# Altium project Framework 2 USB-C Expansion Card.PrjPcb
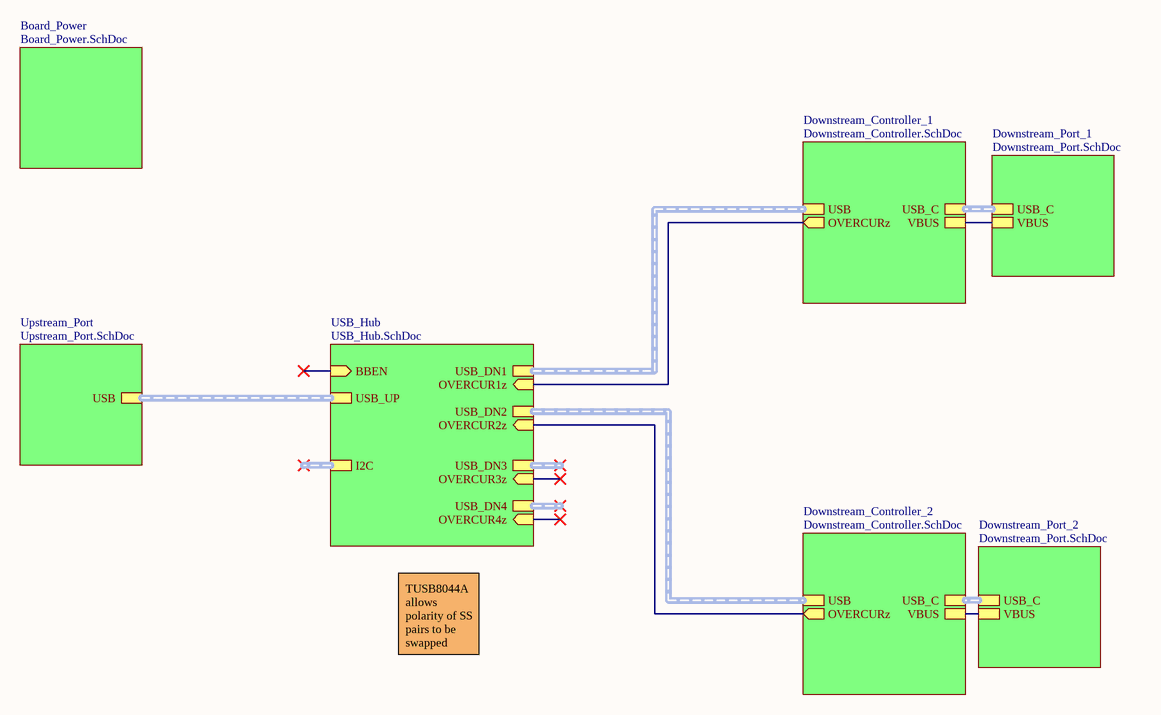
[diagram p0: Top.SchDoc]
CAGE_CODE: ?????; CONTRACT_NUMBER: <CONTRACT NO>; DOC_NO_ASSY_DWG: <ASSY DWG NO>; DOC_NO_BOM: <BOM DOC NO>; DOC_NO_FAB_DWG: <FAB DWG NO>; DOC_NO_SCH_DWG: <SCH DWG NO>; PCB_2_DEC_TOL: +/-.01; PCB_3_DEC_TOL: +/-.010; PCB_ANG_TOL: +/-1/2; PCB_ASSEMBLY_NO: <PCB ASSY NO>; PCB_CHECKER: - -----; PCB_CHECKER_APP_DATE: --/--/----; PCB_DESIGNER: - -----; PCB_DESIGNER_APP_DATE: --/--/----; PCB_DWG_NO: <PCB DWG NO>; PCB_ENGINEER: - -----; PCB_ENGINEER_APP_DATE: --/--/----; PCB_PART_NUMBER: <PCB PN>; PCB_REV: A; SCH_REV: A
6 sheets, 87 parts. Net scope: hierarchical (ports join the sheet entries above them; power ports are global).
Board file: PCB1.PcbDoc
Sheets:
  Top.SchDoc
    Downstream_Controller_1 = Downstream_Controller.SchDoc
    Upstream_Port = Upstream_Port.SchDoc
    Board_Power = Board_Power.SchDoc
    USB_Hub = USB_Hub.SchDoc
    Downstream_Controller_2 = Downstream_Controller.SchDoc
    Downstream_Port_1 = Downstream_Port.SchDoc
    Downstream_Port_2 = Downstream_Port.SchDoc

## Sheet Top.SchDoc: USBC Hub
size 431 x 279 mm; Author: Eric Liu; SheetNumber: 1; SheetTotal: 6

### Sub-sheets
Board_Power = Board_Power.SchDoc: no entries
Downstream_Controller_1 = Downstream_Controller.SchDoc: USB (harness USB), OVERCURz (out), USB_C (harness USB_C), VBUS
Downstream_Controller_2 = Downstream_Controller.SchDoc: USB (harness USB), OVERCURz (out), USB_C (harness USB_C), VBUS
Downstream_Port_1 = Downstream_Port.SchDoc: USB_C (harness USB_C), VBUS
Downstream_Port_2 = Downstream_Port.SchDoc: USB_C (harness USB_C), VBUS
Upstream_Port = Upstream_Port.SchDoc: USB (harness USB)
USB_Hub = USB_Hub.SchDoc: I2C (harness USB), USB_UP (harness USB), USB_DN1 (harness USB), USB_DN2 (harness USB), USB_DN3 (harness USB), USB_DN4 (harness USB), OVERCUR1z (in), OVERCUR2z (in), OVERCUR3z (in), OVERCUR4z (in), BBEN (in)

### Nets
OVERCURz: sheet Downstream_Controller_1/OVERCURz, sheet USB_Hub/OVERCUR1z
OVERCURz: sheet USB_Hub/OVERCUR2z, sheet Downstream_Controller_2/OVERCURz  [a separate net that carries the same name]
VBUS: sheet Downstream_Controller_1/VBUS, sheet Downstream_Port_1/VBUS
VBUS: sheet Downstream_Controller_2/VBUS, sheet Downstream_Port_2/VBUS  [a separate net that carries the same name]

### Buses and harness runs
harness sheet Downstream_Controller_1/USB = sheet USB_Hub/USB_DN1
harness sheet Downstream_Controller_1/USB_C = sheet Downstream_Port_1/USB_C
harness sheet Downstream_Controller_2/USB = sheet USB_Hub/USB_DN2
harness sheet Downstream_Controller_2/USB_C = sheet Downstream_Port_2/USB_C
harness sheet Upstream_Port/USB = sheet USB_Hub/USB_UP

### Notes on the sheet
- TUSB8044A allows polarity of SS pairs to be swapped
- DWG. NO.
- REV.
- SHT.
- THIS DOCUMENT AND THE DATA DISCLOSED HEREIN OR HEREWITH IS THE PROPERTY OF ALTIUM LIMITED AND MAY BE FREELY DISTRIBUTED IN WHOLE. NO RIGHTS ARE RESERVED OR EXPRESS OR IMPLIED WARANTEE GIVEN.
- REVISION
- DESCRIPTION
- DATE
- APPROVED
- ENG:
- APPROVALS
- PROJECT
- DSN:
- CHK:
- REFERENCE DOCUMENTS
- PROJECT REVISION:
- TITLE
- DOCUMENT REVISION:
- DESIGN ITEM:
- BOM:
- FAB DWG:
- PCB DWG:
- ASSY DWG:
- SCALE:
- SIZE
- B
- CAGE CODE
- FILE NAME
- DWG NO.
- SHEET
- OF
- REV

## Sheet Downstream_Controller.SchDoc: Downstream Controller
size 431 x 279 mm; Author: Eric Liu; SheetNumber: 2; SheetTotal: 6
Used 2 times, as channels Downstream_Controller_1, Downstream_Controller_2. Parts and nets are listed once, with the designators drawn on the sheet.
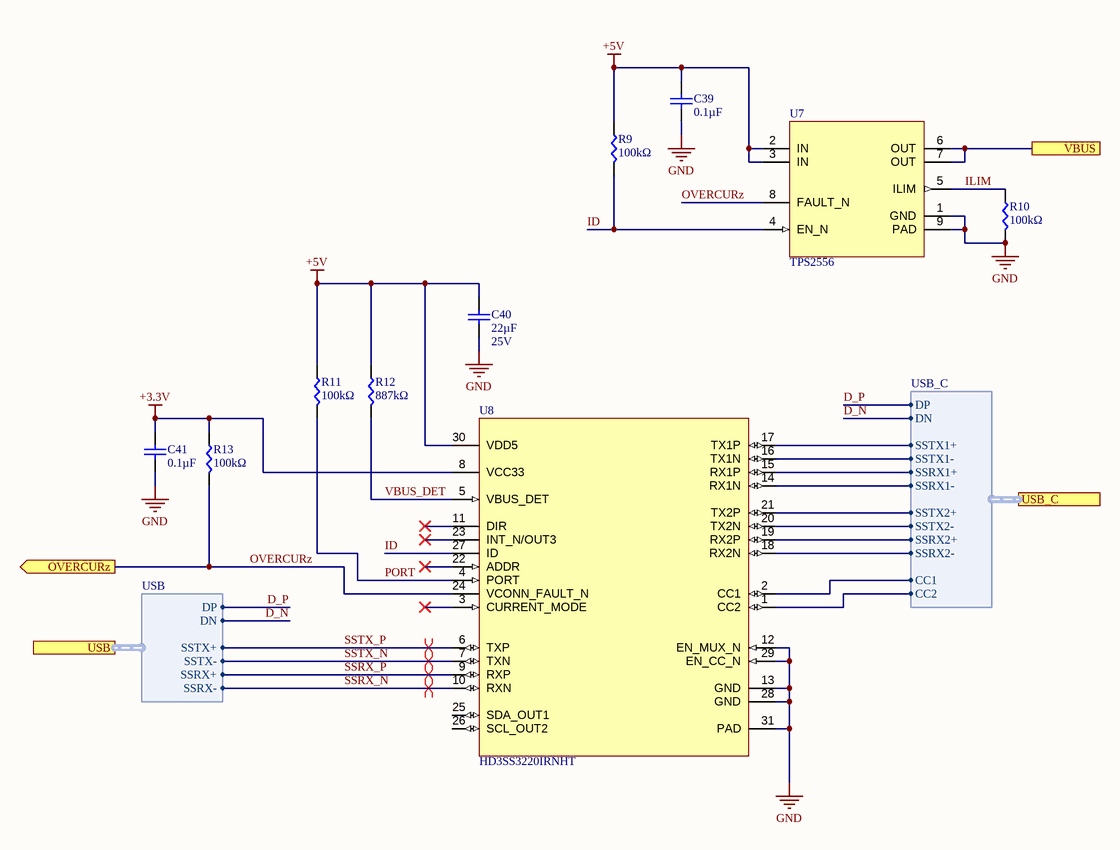
[diagram p1: Downstream_Controller.SchDoc]

### Parts
C39  value 0.1µF  [CAP0402]  (hidden comment: CC0402KRX5R9BB104)
C40  value 22µF  Voltage: 25V  [CAP0805]  (hidden comment: CL21A226MAYNNNE)
C41  value 0.1µF  [CAP0402]  (hidden comment: CC0402KRX5R9BB104)
R9  value 100kΩ  [RES0402]  (hidden comment: ERJ-2RKF1003X)
R10  value 100kΩ  [RES0402]  (hidden comment: ERJ-2RKF1003X)
R11  value 100kΩ  [RES0402]  (hidden comment: ERJ-2RKF1003X)
R12  value 887kΩ  [RES0402]  (hidden comment: RMCF0402FT887K)
R13  value 100kΩ  [RES0402]  (hidden comment: ERJ-2RKF1003X)
U7  TPS2556  [8-SON (3x3)]
U8  HD3SS3220IRNHT  [30-WFQFN Exposed Pad]

### Ports
OVERCURz (out), USB (harness USB), USB_C (harness USB_C), VBUS

### Harnesses
USB: DP, DN, SSRX+, SSRX-, SSTX+, SSTX-
USB_C: DP, DN, SSRX1+, SSRX1-, SSTX1+, SSTX1-, SSRX2+, SSRX2-, SSTX2+, SSTX2-, CC1, CC2

### Nets
+3.3V: C41.2 R13.2 U8.8(VCC33)
+5V: C39.2 C40.2 R9.2 R11.2 R12.2 U7.2(IN) U7.3(IN) U8.30(VDD5)
GND: C39.1 C40.1 C41.1 R10.1 U7.1(GND) U7.9(PAD) U8.12(EN_MUX_N) U8.13(GND) U8.28(GND) U8.29(EN_CC_N) U8.31(PAD)
D_N: port USB.DN, port USB_C.DN
D_P: port USB.DP, port USB_C.DP
ID: R9.1 U7.4(EN_N) U8.27(ID)
ILIM: R10.2 U7.5(ILIM)
OVERCURz: R13.1 U7.8(FAULT_N) U8.24(VCONN_FAULT_N) ; port OVERCURz
PORT: R11.1 U8.4(PORT)
SSRX_N: U8.10(RXN) ; port USB.SSRX-
SSRX_P: U8.9(RXP) ; port USB.SSRX+
SSTX_N: U8.7(TXN) ; port USB.SSTX-
SSTX_P: U8.6(TXP) ; port USB.SSTX+
VBUS: U7.6(OUT) U7.7(OUT) ; port VBUS
VBUS_DET: R12.1 U8.5(VBUS_DET)
NetU8_1: U8.1(CC2) ; port USB_C.CC2
NetU8_2: U8.2(CC1) ; port USB_C.CC1
NetU8_14: U8.14(RX1N) ; port USB_C.SSRX1-
NetU8_15: U8.15(RX1P) ; port USB_C.SSRX1+
NetU8_16: U8.16(TX1N) ; port USB_C.SSTX1-
NetU8_17: U8.17(TX1P) ; port USB_C.SSTX1+
NetU8_18: U8.18(RX2N) ; port USB_C.SSRX2-
NetU8_19: U8.19(RX2P) ; port USB_C.SSRX2+
NetU8_20: U8.20(TX2N) ; port USB_C.SSTX2-
NetU8_21: U8.21(TX2P) ; port USB_C.SSTX2+

Not connected (* = marked no-connect by the designer): U8 3(CURRENT_MODE)* 11(DIR)* 22(ADDR)* 23(INT_N/OUT3)* 25(SDA_OUT1) 26(SCL_OUT2)

### Channels
Downstream_Controller_1: designators end in _1; ports OVERCURz=OVERCURz VBUS=VBUS
Downstream_Controller_2: designators end in _2; ports OVERCURz=OVERCURz VBUS=VBUS

### Layout directives
differential pair: SSRX_N, SSRX_P, SSTX_N, SSTX_P

### Notes on the sheet
- DWG. NO.
- REV.
- SHT.
- THIS DOCUMENT AND THE DATA DISCLOSED HEREIN OR HEREWITH IS THE PROPERTY OF ALTIUM LIMITED AND MAY BE FREELY DISTRIBUTED IN WHOLE. NO RIGHTS ARE RESERVED OR EXPRESS OR IMPLIED WARANTEE GIVEN.
- REVISION
- DESCRIPTION
- DATE
- APPROVED
- ENG:
- APPROVALS
- PROJECT
- DSN:
- CHK:
- REFERENCE DOCUMENTS
- PROJECT REVISION:
- TITLE
- DOCUMENT REVISION:
- DESIGN ITEM:
- BOM:
- FAB DWG:
- PCB DWG:
- ASSY DWG:
- SCALE:
- SIZE
- B
- CAGE CODE
- FILE NAME
- DWG NO.
- SHEET
- OF
- REV

### Library data of the parts
C39 C41 = CC0402KRX5R9BB104: 0.1 µF ±10% 50V Ceramic Capacitor X5R 0402 (1005 Metric); Temperature Coefficient: X5R; Package: 0402 (1005 Metric); Voltage: 50V
C40 = CL21A226MAYNNNE: 22 µF ±20% 25V Ceramic Capacitor X5R 0805 (2012 Metric); Temperature Coefficient: X5R; Package: 0805 (2012 Metric)
R9-R11 R13 = ERJ-2RKF1003X: 100 kOhms ±1% 0.1W, 1/10W Chip Resistor 0402 (1005 Metric) Automotive AEC-Q200 Thick Film; Manufacturer 1: Panasonic Electronic Components; Manufacturer Part Number 1: ERJ-2RKF1003X; Supplier Part Number 1: P100KLCT-ND; Supplier 1: Digi-Key; Power Rating: 1/10W
R12 = RMCF0402FT887K: 887 kOhms ±1% 0.063W, 1/16W Chip Resistor 0402 (1005 Metric) Automotive AEC-Q200 Thick Film; Manufacturer 1: Stackpole Electronics Inc; Manufacturer Part Number 1: RMCF0402FT887K; Supplier Part Number 1: RMCF0402FT887KCT-ND; Supplier 1: Digi-Key; Power Rating: 1/16W
U7 = TPS2556: Power Switch/Driver 1:1 N-Channel 5A 8-SON (3x3); Manufacturer: Texas Instruments; Manufacturer Product Number: TPS2556DRBR; Supplier: DigiKey; Supplier Part Number: 296-39382-1-ND; Datasheet: https://www.ti.com/lit/ds/symlink/tps2557.pdf?ts=1772363913218; Operating Temperature: -40°C ~ 125°C
U8 = HD3SS3220IRNHT: USB, Type-C Controller PMIC 30-WQFN (4.5x2.5); Manufacturer: Texas Instruments; Manufacturer Product Number: HD3SS3220IRNHT; Supplier: DigiKey; Supplier Part Number: 296-43694-1-ND; Datasheet: https://www.ti.com/lit/ds/symlink/hd3ss3220.pdf?HQS=dis-dk-null-digikeymode-dsf-pf-null-wwe&ts=1772376564629&ref_url=https%253A%252F%252Fwww.ti.com%252Fgeneral%252Fdocs%252Fsuppproductinfo.tsp%253FdistId%253D10%2526gotoUrl%253Dhttps%253A%252F%252Fwww.ti.com%252Flit%252Fgpn%252Fhd3ss3220; Operating Temperature: -40°C ~ 85°C

## Sheet Upstream_Port.SchDoc: Upstream Port
size 431 x 279 mm; Author: Eric Liu; SheetNumber: 4; SheetTotal: 6
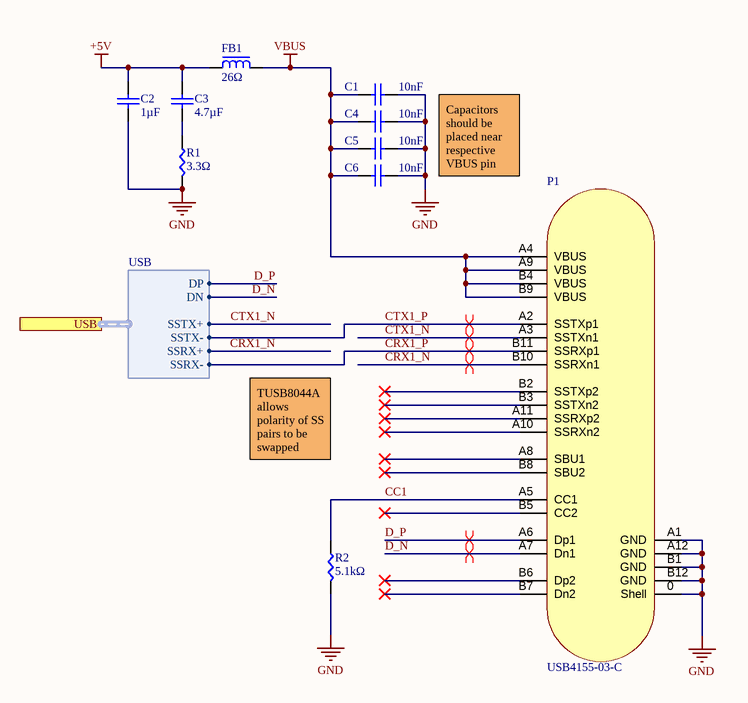
[diagram p2: Upstream_Port.SchDoc]

### Parts
C1  value 10nF  [CAP0402]  (hidden comment: CC0402KRX7R9BB103)
C2  value 1µF  [CAP0402]  (hidden comment: GRM155R61H105KE05D)
C3  value 4.7µF  [CAP0603]  (hidden comment: GRM188R61E475KE11D)
C4  value 10nF  [CAP0402]  (hidden comment: CC0402KRX7R9BB103)
C5  value 10nF  [CAP0402]  (hidden comment: CC0402KRX7R9BB103)
C6  value 10nF  [CAP0402]  (hidden comment: CC0402KRX7R9BB103)
FB1  value 26Ω  [BLM18SG260TN1D]  (hidden comment: BLM18SG260TN1D)
P1  USB4155-03-C  [USB4155-03-C]
R1  value 3.3Ω  [RES0402]  (hidden comment: ESR10EZPJ3R3)
R2  value 5.1kΩ  [RES0402]  (hidden comment: RC0402FR-075K1L)

### Ports
USB (harness USB)

### Harnesses
USB: DP, DN, SSRX+, SSRX-, SSTX+, SSTX-

### Nets
+5V: C2.2 C3.2 FB1.1
GND: C1.1 C2.1 C4.1 C5.1 C6.1 P1.0(Shell) P1.A1(GND) P1.A12(GND) P1.B1(GND) P1.B12(GND) R1.1 R2.1
VBUS: C1.2 C4.2 C5.2 C6.2 FB1.2 P1.A4(VBUS) P1.A9(VBUS) P1.B4(VBUS) P1.B9(VBUS)
CC1: P1.A5(CC1) R2.2
CRX1_N: P1.B10(SSRXn1) ; port USB.SSRX+
CRX1_P: P1.B11(SSRXp1) ; port USB.SSRX-
CTX1_N: P1.A3(SSTXn1) ; port USB.SSTX+
CTX1_P: P1.A2(SSTXp1) ; port USB.SSTX-
D_N: P1.A7(Dn1) ; port USB.DN
D_P: P1.A6(Dp1) ; port USB.DP
NetC3_1: C3.1 R1.2

Not connected (* = marked no-connect by the designer): P1 A8(SBU1)* A10(SSRXn2)* A11(SSRXp2)* B2(SSTXp2)* B3(SSTXn2)* B5(CC2)* B6(Dp2)* B7(Dn2)* B8(SBU2)*

### Layout directives
differential pair: CRX1_N, CRX1_P, CTX1_N, CTX1_P, D_N, D_P

### Notes on the sheet
- Capacitors should be placed near respective VBUS pin
- TUSB8044A allows polarity of SS pairs to be swapped
- DWG. NO.
- REV.
- SHT.
- THIS DOCUMENT AND THE DATA DISCLOSED HEREIN OR HEREWITH IS THE PROPERTY OF ALTIUM LIMITED AND MAY BE FREELY DISTRIBUTED IN WHOLE. NO RIGHTS ARE RESERVED OR EXPRESS OR IMPLIED WARANTEE GIVEN.
- REVISION
- DESCRIPTION
- DATE
- APPROVED
- ENG:
- APPROVALS
- PROJECT
- DSN:
- CHK:
- REFERENCE DOCUMENTS
- PROJECT REVISION:
- TITLE
- DOCUMENT REVISION:
- DESIGN ITEM:
- BOM:
- FAB DWG:
- PCB DWG:
- ASSY DWG:
- SCALE:
- SIZE
- B
- CAGE CODE
- FILE NAME
- DWG NO.
- SHEET
- OF
- REV

### Library data of the parts
C1 C4-C6 = CC0402KRX7R9BB103: 10000 pF ±10% 50V Ceramic Capacitor X7R 0402 (1005 Metric); Temperature Coefficient: X7R; Package: 0402 (1005 Metric); Voltage: 50V
C2 = GRM155R61H105KE05D: 1 µF ±10% 50V Ceramic Capacitor X5R 0402 (1005 Metric); Temperature Coefficient: X5R; Package: 0402 (1005 Metric); Voltage: 50V
C3 = GRM188R61E475KE11D: 4.7 µF ±10% 25V Ceramic Capacitor X5R 0603 (1608 Metric); Temperature Coefficient: X5R; Package: 0603 (1608 Metric); Voltage: 25V
FB1 = BLM18SG260TN1D: 26 Ohms @ 100 MHz 1 Power Line Ferrite Bead 0603 (1608 Metric) 6A 7mOhm; Manufacturer 1: Murata Electronics; Manufacturer Part Number 1: BLM18SG260TN1D; Supplier Part Number 1: 490-3995-1-ND; Supplier 1: Digi-Key; Current Rating: 6A
P1 = USB4155-03-C: USB-C (USB TYPE-C) USB 3.2 Gen 2 (USB 3.1 Gen 2, Superspeed + (USB 3.1)) Plug Connector 24 Position Board Edge, Surface Mount; Through Hole, Right Angle; Manufacturer: GCT; Manufacturer Product Number: USB4056-03-A; Voltage: 48VDC; Supplier: DigiKey; Supplier Part Number: 2073-USB4056-03-ACT-ND; Datasheet: https://gct.co/connector/usb4056; Standards: USB 3.2 Gen 2; Operating Temperature: -25°C ~ 85°C
R1 = ESR10EZPJ3R3: 3.3 Ohms ±5% 0.5W, 1/2W Chip Resistor 0805 (2012 Metric) Automotive AEC-Q200, Pulse Withstanding Thick Film; Manufacturer 1: Rohm Semiconductor; Manufacturer Part Number 1: ESR10EZPJ3R3; Supplier Part Number 1: RHM3.3KCT-ND; Supplier 1: Digi-Key; Power Rating: 1/2W
R2 = RC0402FR-075K1L: 5.1 kOhms ±1% 0.063W, 1/16W Chip Resistor 0402 (1005 Metric) Moisture Resistant Thick Film; Manufacturer 1: YAGEO; Manufacturer Part Number 1: RC0402FR-075K1L; Supplier Part Number 1: 311-5.10KLRCT-ND; Supplier 1: Digi-Key; Power Rating: 1/16W

## Sheet Board_Power.SchDoc: Board Power
size 431 x 279 mm; Author: Eric Liu; SheetNumber: 5; SheetTotal: 6
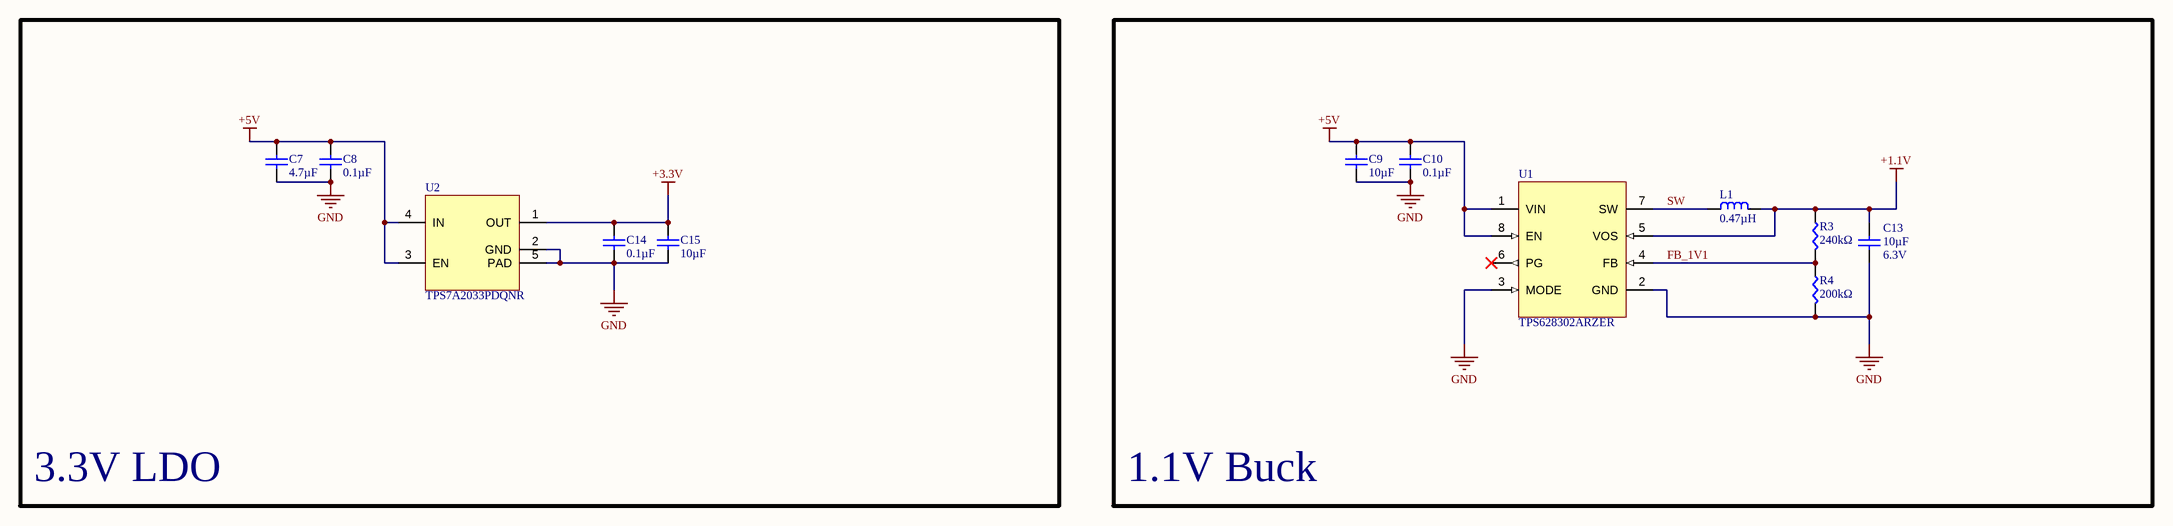
[diagram p3: Board_Power.SchDoc]

### Parts
C7  value 4.7µF  [CAP0603]  (hidden comment: GRT21BR61H475KE13L)
C8  value 0.1µF  [CAP0402]  (hidden comment: CC0402KRX5R9BB104)
C9  value 10µF  [CAP0402]  (hidden comment: GRM1555C1H221JA01D)
C10  value 0.1µF  [CAP0402]  (hidden comment: CC0402KRX5R9BB104)
C13  value 10µF  Voltage: 6.3V  [CAP0402]  (hidden comment: CL05A106MQ5NUNC)
C14  value 0.1µF  [CAP0402]  (hidden comment: CC0402KRX5R9BB104)
C15  value 10µF  [CAP0402]  (hidden comment: CL05A106MQ5NUNC)
L1  value 0.47µH  [IND0806]  (hidden comment: CIGT201610EHR47MNE)
R3  value 240kΩ  [RES0402]  (hidden comment: RC0402FR-0790K9L)
R4  value 200kΩ  [RES0402]  (hidden comment: ERJ-2RKF3002X)
U1  TPS628302ARZER  [WQFN-HR8_RZE_TEX]
U2  TPS7A2033PDQNR  [4-X2SON]

### Blocks framed on the sheet
3.3V LDO: C7 C8 C14 C15 U2
1.1V Buck: C9 C10 C13 L1 R3 R4 U1

### Nets
+1.1V: C13.2 L1.2 R3.2 U1.5(VOS)
+3.3V: C14.2 C15.2 U2.1(OUT)
+5V: C7.2 C8.2 C9.2 C10.2 U1.1(VIN) U1.8(EN) U2.3(EN) U2.4(IN)
GND: C7.1 C8.1 C9.1 C10.1 C13.1 C14.1 C15.1 R4.1 U1.2(GND) U1.3(MODE) U2.2(GND) U2.5(PAD)
FB_1V1: R3.1 R4.2 U1.4(FB)
SW: L1.1 U1.7(SW)

Not connected (* = marked no-connect by the designer): U1 6(PG)*

### Notes on the sheet
- DWG. NO.
- REV.
- SHT.
- THIS DOCUMENT AND THE DATA DISCLOSED HEREIN OR HEREWITH IS THE PROPERTY OF ALTIUM LIMITED AND MAY BE FREELY DISTRIBUTED IN WHOLE. NO RIGHTS ARE RESERVED OR EXPRESS OR IMPLIED WARANTEE GIVEN.
- REVISION
- DESCRIPTION
- DATE
- APPROVED
- ENG:
- APPROVALS
- PROJECT
- DSN:
- CHK:
- REFERENCE DOCUMENTS
- PROJECT REVISION:
- TITLE
- DOCUMENT REVISION:
- DESIGN ITEM:
- BOM:
- FAB DWG:
- PCB DWG:
- ASSY DWG:
- SCALE:
- SIZE
- B
- CAGE CODE
- FILE NAME
- DWG NO.
- SHEET
- OF
- REV

### Library data of the parts
C7 = GRM188R61E475KE11D: as C3 on sheet Upstream_Port; Temperature Coefficient: X5R; Package: 0603 (1608 Metric); Voltage: 25V
C8 C10 C14 = CC0402KRX5R9BB104: as C39 on sheet Downstream_Controller; Temperature Coefficient: X5R; Package: 0402 (1005 Metric); Voltage: 50V
C9 = GRM155R61A106ME11D: 10 µF ±20% 10V Ceramic Capacitor X5R 0402 (1005 Metric); Temperature Coefficient: X5R; Package: 0402 (1005 Metric); Voltage: 10V
C13 C15 = CL05A106MQ5NUNC: 10 µF ±20% 6.3V Ceramic Capacitor X5R 0402 (1005 Metric); Temperature Coefficient: C0G, NP0; Package: 0402 (1005 Metric)
  C15: Voltage: 6.3V
L1 = CIGT201610EHR47MNE: 470 nH Shielded Thin Film Inductor 4.8 A 22mOhm Max 0806 (2016 Metric); Manufacturer 1: Samsung Electro-Mechanics; Current Rating: 4.8A; Current - Saturation (Isat): 5.9A; Manufacturer Part Number 1: CIGT201610EHR47MNE; Supplier Part Number 1: 1276-6902-1-ND; Supplier 1: Digi-Key
R3 = RC0402FR-07240KL: 240 kOhms ±1% 0.063W, 1/16W Chip Resistor 0402 (1005 Metric) Moisture Resistant Thick Film; Manufacturer 1: YAGEO; Manufacturer Part Number 1: RC0402FR-07240KL; Supplier Part Number 1: 311-240KLRCT-ND; Supplier 1: Digi-Key; Power Rating: 1/16W
R4 = ERJ-2RKF2003X: 200 kOhms ±1% 0.1W, 1/10W Chip Resistor 0402 (1005 Metric) Automotive AEC-Q200 Thick Film; Manufacturer 1: Panasonic Electronic Components; Manufacturer Part Number 1: ERJ-2RKF2003X; Supplier Part Number 1: P200KLCT-ND; Supplier 1: Digi-Key; Power Rating: 1/10W
U1 = TPS628302ARZER: Buck Switching Regulator IC Positive Adjustable 0.5V 1 Output 2A 8-WFDFN; Manufacturer: Texas Instruments; Manufacturer Product Number: TPS628302ARZER; Supplier: DigiKey; Supplier Part Number: 296-TPS628302ARZERCT-ND; Datasheet: https://www.ti.com/lit/ds/symlink/tps628302.pdf?ts=1772906536972&ref_url=https%253A%252F%252Fwww.ti.com%252Fproduct%252FTPS628302; Operating Temperature: -40°C ~ 125°C
U2 = TPS7A2033PDQNR: Linear Voltage Regulator IC Positive Fixed 1 Output 300mA 4-X2SON (1x1); Manufacturer: Texas Instruments; Manufacturer Product Number: TPS7A2033PDQNR; Supplier: DigiKey; Supplier Part Number: 296-TPS7A2033PDQNRCT-ND; Datasheet: https://www.ti.com/lit/ds/symlink/tps7a20.pdf?HQS=dis-dk-null-digikeymode-dsf-pf-null-wwe&ts=1772479101747; Operating Temperature: -40°C ~ 125°C

## Sheet USB_Hub.SchDoc: USB Hub
size 431 x 279 mm; Author: Eric Liu; SheetNumber: 6; SheetTotal: 6
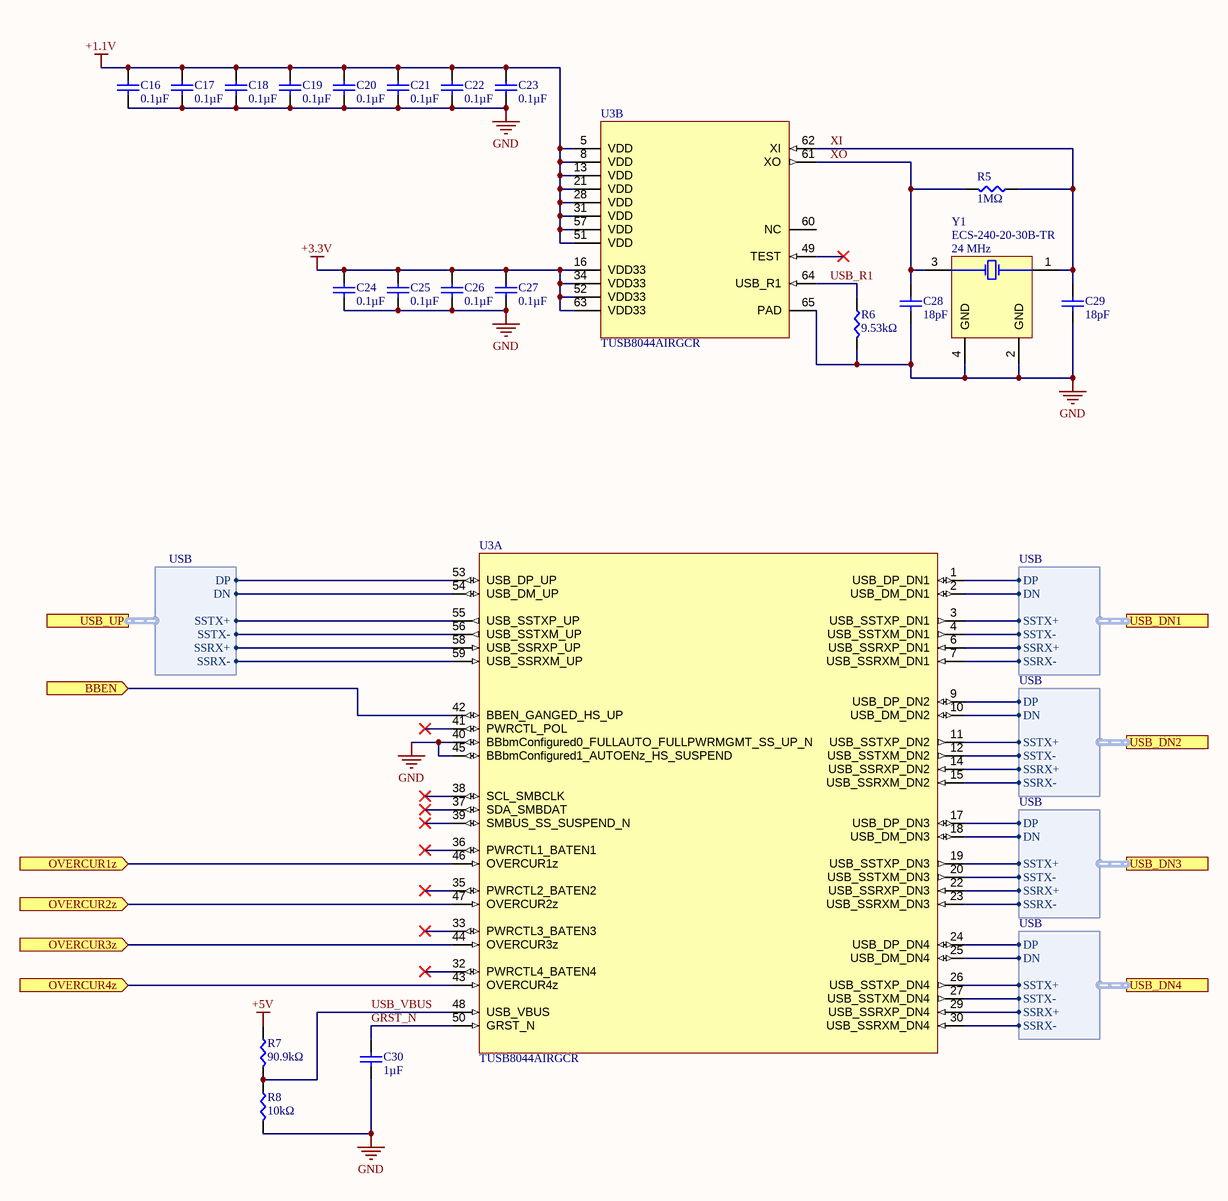
[diagram p4: USB_Hub.SchDoc]

### Parts
C16  value 0.1µF  [CAP0402]  (hidden comment: CC0402KRX5R9BB104)
C17  value 0.1µF  [CAP0402]  (hidden comment: CC0402KRX5R9BB104)
C18  value 0.1µF  [CAP0402]  (hidden comment: CC0402KRX5R9BB104)
C19  value 0.1µF  [CAP0402]  (hidden comment: CC0402KRX5R9BB104)
C20  value 0.1µF  [CAP0402]  (hidden comment: CC0402KRX5R9BB104)
C21  value 0.1µF  [CAP0402]  (hidden comment: CC0402KRX5R9BB104)
C22  value 0.1µF  [CAP0402]  (hidden comment: CC0402KRX5R9BB104)
C23  value 0.1µF  [CAP0402]  (hidden comment: CC0402KRX5R9BB104)
C24  value 0.1µF  [CAP0402]  (hidden comment: CC0402KRX5R9BB104)
C25  value 0.1µF  [CAP0402]  (hidden comment: CC0402KRX5R9BB104)
C26  value 0.1µF  [CAP0402]  (hidden comment: CC0402KRX5R9BB104)
C27  value 0.1µF  [CAP0402]  (hidden comment: CC0402KRX5R9BB104)
C28  value 18pF  [CAP0402]  (hidden comment: GJM1555C1H180FB01D)
C29  value 18pF  [CAP0402]  (hidden comment: GJM1555C1H180FB01D)
C30  value 1µF  [CAP0402]  (hidden comment: GRM155R61H105KE05D)
R5  value 1MΩ  [RES0402]  (hidden comment: RC0402FR-071ML)
R6  value 9.53kΩ  [RES0402]  (hidden comment: CRCW04029K53FKED)
R7  value 90.9kΩ  [RES0402]  (hidden comment: RC0402FR-0790K9L)
R8  value 10kΩ  [RES0402]  (hidden comment: RC0402FR-0710KL)
U3  TUSB8044AIRGCR  [RGC0064G]  (parts A,B of 2)
Y1  ECS-240-20-30B-TR  value 24 MHz  [ECS-240-20-30B-TR]

### Ports
BBEN (in), OVERCUR1z (in), OVERCUR2z (in), OVERCUR3z (in), OVERCUR4z (in), USB_DN1 (harness USB), USB_DN2 (harness USB), USB_DN3 (harness USB), USB_DN4 (harness USB), USB_UP (harness USB)

### Harnesses
USB: DP, DN, SSRX+, SSRX-, SSTX+, SSTX-

### Nets
+1.1V: C16.2 C17.2 C18.2 C19.2 C20.2 C21.2 C22.2 C23.2 U3.5(VDD) U3.8(VDD) U3.13(VDD) U3.21(VDD) U3.28(VDD) U3.31(VDD) U3.51(VDD) U3.57(VDD)
+3.3V: C24.2 C25.2 C26.2 C27.2 U3.16(VDD33) U3.34(VDD33) U3.52(VDD33) U3.63(VDD33)
+5V: R7.2
GND: C16.1 C17.1 C18.1 C19.1 C20.1 C21.1 C22.1 C23.1 C24.1 C25.1 C26.1 C27.1 C28.1 C29.1 C30.1 R6.1 R8.1 U3.40(BBbmConfigured0_FULLAUTO_FULLPWRMGMT_SS_UP_N) U3.45(BBbmConfigured1_AUTOENz_HS_SUSPEND) U3.65(PAD) Y1.2(GND) Y1.4(GND)
CRX1_N: U3.58(USB_SSRXP_UP) ; port USB_UP.SSRX+
CRX1_P: U3.59(USB_SSRXM_UP) ; port USB_UP.SSRX-
CTX1_N: U3.55(USB_SSTXP_UP) ; port USB_UP.SSTX+
CTX1_P: U3.56(USB_SSTXM_UP) ; port USB_UP.SSTX-
D_N: U3.54(USB_DM_UP) ; port USB_UP.DN
D_N: U3.2(USB_DM_DN1) ; port USB_DN1.DN  [a separate net that carries the same name]
D_N: U3.10(USB_DM_DN2) ; port USB_DN2.DN  [a separate net that carries the same name]
D_P: U3.53(USB_DP_UP) ; port USB_UP.DP
D_P: U3.1(USB_DP_DN1) ; port USB_DN1.DP  [a separate net that carries the same name]
D_P: U3.9(USB_DP_DN2) ; port USB_DN2.DP  [a separate net that carries the same name]
GRST_N: C30.2 U3.50(GRST_N)
OVERCURz: U3.46(OVERCUR1z) ; port OVERCUR1z
OVERCURz: U3.47(OVERCUR2z) ; port OVERCUR2z  [a separate net that carries the same name]
SSRX_N: U3.7(USB_SSRXM_DN1) ; port USB_DN1.SSRX-
SSRX_N: U3.15(USB_SSRXM_DN2) ; port USB_DN2.SSRX-  [a separate net that carries the same name]
SSRX_P: U3.6(USB_SSRXP_DN1) ; port USB_DN1.SSRX+
SSRX_P: U3.14(USB_SSRXP_DN2) ; port USB_DN2.SSRX+  [a separate net that carries the same name]
SSTX_N: U3.4(USB_SSTXM_DN1) ; port USB_DN1.SSTX-
SSTX_N: U3.12(USB_SSTXM_DN2) ; port USB_DN2.SSTX-  [a separate net that carries the same name]
SSTX_P: U3.3(USB_SSTXP_DN1) ; port USB_DN1.SSTX+
SSTX_P: U3.11(USB_SSTXP_DN2) ; port USB_DN2.SSTX+  [a separate net that carries the same name]
USB_R1: R6.2 U3.64(USB_R1)
USB_VBUS: R7.1 R8.2 U3.48(USB_VBUS)
XI: C29.2 R5.2 U3.62(XI) Y1.1
XO: C28.2 R5.1 U3.61(XO) Y1.3
NetU3_17: U3.17(USB_DP_DN3) ; port USB_DN3.DP
NetU3_18: U3.18(USB_DM_DN3) ; port USB_DN3.DN
NetU3_19: U3.19(USB_SSTXP_DN3) ; port USB_DN3.SSTX+
NetU3_20: U3.20(USB_SSTXM_DN3) ; port USB_DN3.SSTX-
NetU3_22: U3.22(USB_SSRXP_DN3) ; port USB_DN3.SSRX+
NetU3_23: U3.23(USB_SSRXM_DN3) ; port USB_DN3.SSRX-
NetU3_24: U3.24(USB_DP_DN4) ; port USB_DN4.DP
NetU3_25: U3.25(USB_DM_DN4) ; port USB_DN4.DN
NetU3_26: U3.26(USB_SSTXP_DN4) ; port USB_DN4.SSTX+
NetU3_27: U3.27(USB_SSTXM_DN4) ; port USB_DN4.SSTX-
NetU3_29: U3.29(USB_SSRXP_DN4) ; port USB_DN4.SSRX+
NetU3_30: U3.30(USB_SSRXM_DN4) ; port USB_DN4.SSRX-
NetU3_42: U3.42(BBEN_GANGED_HS_UP) ; port BBEN
NetU3_43: U3.43(OVERCUR4z) ; port OVERCUR4z
NetU3_44: U3.44(OVERCUR3z) ; port OVERCUR3z

Not connected (* = marked no-connect by the designer): U3 32(PWRCTL4_BATEN4)* 33(PWRCTL3_BATEN3)* 35(PWRCTL2_BATEN2)* 36(PWRCTL1_BATEN1)* 37(SDA_SMBDAT)* 38(SCL_SMBCLK)* 39(SMBUS_SS_SUSPEND_N)* 41(PWRCTL_POL)* 49(TEST)* 60(NC)

### Notes on the sheet
- DWG. NO.
- REV.
- SHT.
- THIS DOCUMENT AND THE DATA DISCLOSED HEREIN OR HEREWITH IS THE PROPERTY OF ALTIUM LIMITED AND MAY BE FREELY DISTRIBUTED IN WHOLE. NO RIGHTS ARE RESERVED OR EXPRESS OR IMPLIED WARANTEE GIVEN.
- REVISION
- DESCRIPTION
- DATE
- APPROVED
- ENG:
- APPROVALS
- PROJECT
- DSN:
- CHK:
- REFERENCE DOCUMENTS
- PROJECT REVISION:
- TITLE
- DOCUMENT REVISION:
- DESIGN ITEM:
- BOM:
- FAB DWG:
- PCB DWG:
- ASSY DWG:
- SCALE:
- SIZE
- B
- CAGE CODE
- FILE NAME
- DWG NO.
- SHEET
- OF
- REV

### Library data of the parts
C16-C27 = CC0402KRX5R9BB104: as C39 on sheet Downstream_Controller; Temperature Coefficient: X5R; Package: 0402 (1005 Metric); Voltage: 50V
C28 C29 = GJM1555C1H180FB01D: 18 pF ±1% 50V Ceramic Capacitor C0G, NP0 0402 (1005 Metric); Temperature Coefficient: C0G, NP0; Package: 0402 (1005 Metric); Voltage: 50V
C30 = GRM155R61H105KE05D: as C2 on sheet Upstream_Port; Temperature Coefficient: X5R; Package: 0402 (1005 Metric); Voltage: 50V
R5 = RC0402FR-071ML: 1 MOhms ±1% 0.063W, 1/16W Chip Resistor 0402 (1005 Metric) Moisture Resistant Thick Film; Manufacturer 1: YAGEO; Manufacturer Part Number 1: RC0402FR-071ML; Supplier Part Number 1: 311-1.00MLRCT-ND; Supplier 1: Digi-Key; Power Rating: 1/16W
R6 = CRCW04029K53FKED: 9.53 kOhms ±1% 0.1W, 1/10W Chip Resistor 0402 (1005 Metric) Automotive AEC-Q200 Thick Film; Manufacturer 1: Vishay Dale; Manufacturer Part Number 1: CRCW04029K53FKED; Supplier Part Number 1: 541-9.53KLCT-ND; Supplier 1: Digi-Key; Power Rating: 1/10W
R7 = RC0402FR-0790K9L: 90.9 kOhms ±1% 0.063W, 1/16W Chip Resistor 0402 (1005 Metric) Moisture Resistant Thick Film; Manufacturer 1: YAGEO; Manufacturer Part Number 1: RC0402FR-0751KL; Supplier Part Number 1: 311-51.0KLRCT-ND; Supplier 1: Digi-Key; Power Rating: 1/16W
R8 = RC0402FR-0710KL: 10 kOhms ±1% 0.063W, 1/16W Chip Resistor 0402 (1005 Metric) Moisture Resistant Thick Film; Manufacturer 1: YAGEO; Manufacturer Part Number 1: RC0402FR-0710KL; Supplier Part Number 1: 311-10.0KLRCT-ND; Supplier 1: Digi-Key; Power Rating: 1/16W
U3 = TUSB8044AIRGCR: Four-port USB 3.2 x1 Gen1 hub with USB billboard 64-VQFN -40 to 85; Manufacturer_Name: Texas Instruments; TYPE: TYPE; RefDes: RefDes; Copyright: Copyright (C) 2026 Ultra Librarian. All rights reserved.; Manufacturer_Part_Number: TUSB8044AIRGCR; Datasheet: https://www.ti.com/lit/gpn/tusb8044a
Y1 = ECS-240-20-30B-TR: 24 MHz ±30ppm Crystal 20pF 30 Ohms 4-SMD, No Lead; Manufacturer 1: ECS Inc.; ESR (Equivalent Series Resistance): 30Ω; Manufacturer Part Number 1: ECS-240-20-30B-TR; Supplier Part Number 1: XC1122CT-ND; Supplier 1: Digi-Key; Load Capacitance: 20pF

## Sheet Downstream_Port.SchDoc: Downstream Port
size 431 x 279 mm; Author: Eric Liu; SheetNumber: 3; SheetTotal: 6
Used 2 times, as channels Downstream_Port_1, Downstream_Port_2. Parts and nets are listed once, with the designators drawn on the sheet.
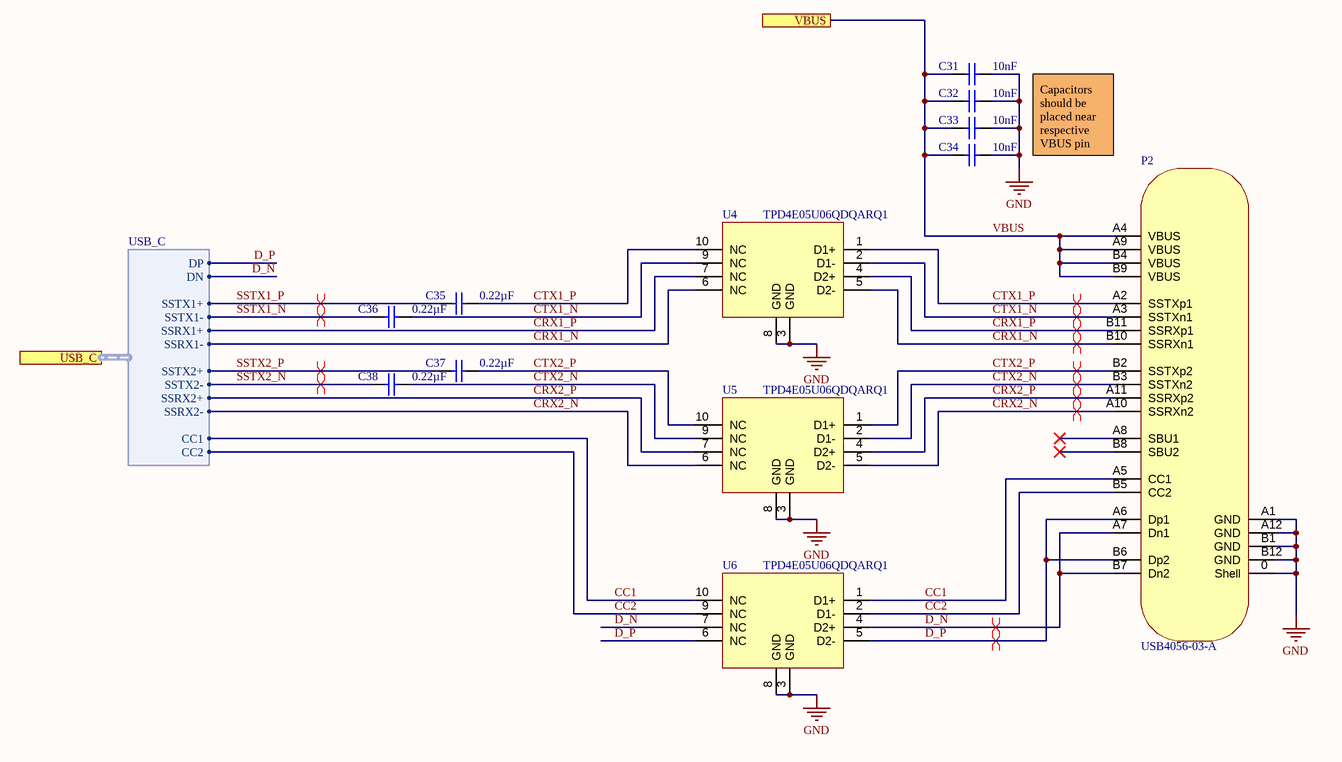
[diagram p5: Downstream_Port.SchDoc]

### Parts
C31  value 10nF  [CAP0402]  (hidden comment: CC0402KRX7R9BB103)
C32  value 10nF  [CAP0402]  (hidden comment: CC0402KRX7R9BB103)
C33  value 10nF  [CAP0402]  (hidden comment: CC0402KRX7R9BB103)
C34  value 10nF  [CAP0402]  (hidden comment: CC0402KRX7R9BB103)
C35  value 0.22µF  [CAP0402]  (hidden comment: UMK105BJ224KV-F)
C36  value 0.22µF  [CAP0402]  (hidden comment: UMK105BJ224KV-F)
C37  value 0.22µF  [CAP0402]  (hidden comment: UMK105BJ224KV-F)
C38  value 0.22µF  [CAP0402]  (hidden comment: UMK105BJ224KV-F)
P2  USB4056-03-A  [USB4056-03-A]
U4  TPD4E05U06QDQARQ1  [10-UFDFN]
U5  TPD4E05U06QDQARQ1  [10-UFDFN]
U6  TPD4E05U06QDQARQ1  [10-UFDFN]

### Ports
USB_C (harness USB_C), VBUS

### Harnesses
USB_C: DP, DN, SSRX1+, SSRX1-, SSTX1+, SSTX1-, SSRX2+, SSRX2-, SSTX2+, SSTX2-, CC1, CC2

### Nets
GND: C31.1 C32.1 C33.1 C34.1 P2.0(Shell) P2.A1(GND) P2.A12(GND) P2.B1(GND) P2.B12(GND) U4.3(GND) U4.8(GND) U5.3(GND) U5.8(GND) U6.3(GND) U6.8(GND)
CC1: P2.A5(CC1) U6.1(D1+) U6.10(NC) ; port USB_C.CC1
CC2: P2.B5(CC2) U6.2(D1-) U6.9(NC) ; port USB_C.CC2
CRX1_N: P2.B10(SSRXn1) U4.5(D2-) U4.6(NC) ; port USB_C.SSRX1-
CRX1_P: P2.B11(SSRXp1) U4.4(D2+) U4.7(NC) ; port USB_C.SSRX1+
CRX2_N: P2.A10(SSRXn2) U5.5(D2-) U5.6(NC) ; port USB_C.SSRX2-
CRX2_P: P2.A11(SSRXp2) U5.4(D2+) U5.7(NC) ; port USB_C.SSRX2+
CTX1_N: C36.2 P2.A3(SSTXn1) U4.2(D1-) U4.9(NC)
CTX1_P: C35.2 P2.A2(SSTXp1) U4.1(D1+) U4.10(NC)
CTX2_N: C38.2 P2.B3(SSTXn2) U5.2(D1-) U5.9(NC)
CTX2_P: C37.2 P2.B2(SSTXp2) U5.1(D1+) U5.10(NC)
D_N: P2.A7(Dn1) P2.B7(Dn2) U6.4(D2+) U6.7(NC) ; port USB_C.DN
D_P: P2.A6(Dp1) P2.B6(Dp2) U6.5(D2-) U6.6(NC) ; port USB_C.DP
SSTX1_N: C36.1 ; port USB_C.SSTX1-
SSTX1_P: C35.1 ; port USB_C.SSTX1+
SSTX2_N: C38.1 ; port USB_C.SSTX2-
SSTX2_P: C37.1 ; port USB_C.SSTX2+
VBUS: C31.2 C32.2 C33.2 C34.2 P2.A4(VBUS) P2.A9(VBUS) P2.B4(VBUS) P2.B9(VBUS) ; port VBUS

Not connected (* = marked no-connect by the designer): P2 A8(SBU1)* B8(SBU2)*

### Channels
Downstream_Port_1: designators end in _1; ports VBUS=VBUS
Downstream_Port_2: designators end in _2; ports VBUS=VBUS

### Layout directives
differential pair: CRX1_N, CRX1_P, CRX2_N, CRX2_P, CTX1_N_Downstream_Port_1, CTX1_P_Downstream_Port_1, CTX2_N_Downstream_Port_1, CTX2_P_Downstream_Port_1, D_N, D_P, SSTX1_N, SSTX1_P, SSTX2_N, SSTX2_P

### Notes on the sheet
- Capacitors should be placed near respective VBUS pin
- DWG. NO.
- REV.
- SHT.
- THIS DOCUMENT AND THE DATA DISCLOSED HEREIN OR HEREWITH IS THE PROPERTY OF ALTIUM LIMITED AND MAY BE FREELY DISTRIBUTED IN WHOLE. NO RIGHTS ARE RESERVED OR EXPRESS OR IMPLIED WARANTEE GIVEN.
- REVISION
- DESCRIPTION
- DATE
- APPROVED
- ENG:
- APPROVALS
- PROJECT
- DSN:
- CHK:
- REFERENCE DOCUMENTS
- PROJECT REVISION:
- TITLE
- DOCUMENT REVISION:
- DESIGN ITEM:
- BOM:
- FAB DWG:
- PCB DWG:
- ASSY DWG:
- SCALE:
- SIZE
- B
- CAGE CODE
- FILE NAME
- DWG NO.
- SHEET
- OF
- REV

### Library data of the parts
C31-C34 = CC0402KRX7R9BB103: as C1 on sheet Upstream_Port; Temperature Coefficient: X7R; Package: 0402 (1005 Metric); Voltage: 50V
C35-C38 = UMK105BJ224KV-F: 0.22 µF ±10% 50V Ceramic Capacitor X5R 0402 (1005 Metric); Temperature Coefficient: X5R; Package: 0402 (1005 Metric); Voltage: 50V
P2 = USB4056-03-A: USB-C (USB TYPE-C) USB 3.2 Gen 2 (USB 3.1 Gen 2, Superspeed + (USB 3.1)) Receptacle Connector 24 Position Surface Mount, Right Angle; Through Hole; Manufacturer: GCT; Voltage: 48VDC; Manufacturer Product Number: USB4056-03-A; Supplier: DigiKey; Supplier Part Number: 2073-USB4056-03-ACT-ND; Datasheet: https://gct.co/connector/usb4056; Standards: USB 3.2 Gen 2; Operating Temperature: -25°C ~ 85°C
U4-U6 = TPD4E05U06QDQARQ1: 14V Clamp 2.5A (8/20µs) Ipp Tvs Diode Surface Mount 10-USON (2.5x1); Manufacturer: Texas Instruments; Manufacturer Product Number: TPD4E05U06QDQARQ1; Supplier: DigiKey; Supplier Part Number: 296-40696-1-ND; Datasheet: https://www.ti.com/lit/ds/symlink/tpd4e05u06-q1.pdf?HQS=dis-dk-null-digikeymode-dsf-pf-null-wwe&ts=1772378762932&ref_url=https%253A%252F%252Fwww.ti.com%252Fgeneral%252Fdocs%252Fsuppproductinfo.tsp%253FdistId%253D10%2526gotoUrl%253Dhttps%253A%252F%252Fwww.ti.com%252Flit%252Fgpn%252Ftpd4e05u06-q1; Operating Temperature: -40°C ~ 125°C

## Nets that join several sheets
+1.1V: Board_Power (C13.2 L1.2 R3.2 U1.5), USB_Hub (16 pins)
+3.3V: Downstream_Controller_1 (C41_1.2 R13_1.2 U8_1.8), Board_Power (C14.2 C15.2 U2.1), USB_Hub (8 pins), Downstream_Controller_2 (C41_2.2 R13_2.2 U8_2.8)
+5V: Downstream_Controller_1 (8 pins), Upstream_Port (C2.2 C3.2 FB1.1), Board_Power (8 pins), USB_Hub (R7.2), Downstream_Controller_2 (8 pins)
GND: Downstream_Controller_1 (11 pins), Upstream_Port (12 pins), Board_Power (12 pins), USB_Hub (22 pins), Downstream_Controller_2 (11 pins), Downstream_Port_1 (15 pins), Downstream_Port_2 (15 pins)
CC1: Downstream_Controller_1 (U8_1.2), Downstream_Port_1 (P2_1.A5 U6_1.1 U6_1.10)
CC1: Downstream_Controller_2 (U8_2.2), Downstream_Port_2 (P2_2.A5 U6_2.1 U6_2.10)
CC2: Downstream_Controller_1 (U8_1.1), Downstream_Port_1 (P2_1.B5 U6_1.2 U6_1.9)
CC2: Downstream_Controller_2 (U8_2.1), Downstream_Port_2 (P2_2.B5 U6_2.2 U6_2.9)
CRX1_N: Downstream_Controller_1 (U8_1.14), Downstream_Port_1 (P2_1.B10 U4_1.5 U4_1.6)
CRX1_N: Upstream_Port (P1.B10), USB_Hub (U3.58)
CRX1_N: Downstream_Controller_2 (U8_2.14), Downstream_Port_2 (P2_2.B10 U4_2.5 U4_2.6)
CRX1_P: Downstream_Controller_1 (U8_1.15), Downstream_Port_1 (P2_1.B11 U4_1.4 U4_1.7)
CRX1_P: Upstream_Port (P1.B11), USB_Hub (U3.59)
CRX1_P: Downstream_Controller_2 (U8_2.15), Downstream_Port_2 (P2_2.B11 U4_2.4 U4_2.7)
CRX2_N: Downstream_Controller_1 (U8_1.18), Downstream_Port_1 (P2_1.A10 U5_1.5 U5_1.6)
CRX2_N: Downstream_Controller_2 (U8_2.18), Downstream_Port_2 (P2_2.A10 U5_2.5 U5_2.6)
CRX2_P: Downstream_Controller_1 (U8_1.19), Downstream_Port_1 (P2_1.A11 U5_1.4 U5_1.7)
CRX2_P: Downstream_Controller_2 (U8_2.19), Downstream_Port_2 (P2_2.A11 U5_2.4 U5_2.7)
CTX1_N: Upstream_Port (P1.A3), USB_Hub (U3.55)
CTX1_P: Upstream_Port (P1.A2), USB_Hub (U3.56)
D_N: Upstream_Port (P1.A7), USB_Hub (U3.54)
D_N: USB_Hub (U3.2), Downstream_Port_1 (P2_1.A7 P2_1.B7 U6_1.4 U6_1.7)
D_N: USB_Hub (U3.10), Downstream_Port_2 (P2_2.A7 P2_2.B7 U6_2.4 U6_2.7)
D_P: Upstream_Port (P1.A6), USB_Hub (U3.53)
D_P: USB_Hub (U3.1), Downstream_Port_1 (P2_1.A6 P2_1.B6 U6_1.5 U6_1.6)
D_P: USB_Hub (U3.9), Downstream_Port_2 (P2_2.A6 P2_2.B6 U6_2.5 U6_2.6)
OVERCURz: Downstream_Controller_1 (R13_1.1 U7_1.8 U8_1.24), USB_Hub (U3.46)
OVERCURz: USB_Hub (U3.47), Downstream_Controller_2 (R13_2.1 U7_2.8 U8_2.24)
SSRX_N: Downstream_Controller_1 (U8_1.10), USB_Hub (U3.7)
SSRX_N: USB_Hub (U3.15), Downstream_Controller_2 (U8_2.10)
SSRX_P: Downstream_Controller_1 (U8_1.9), USB_Hub (U3.6)
SSRX_P: USB_Hub (U3.14), Downstream_Controller_2 (U8_2.9)
SSTX1_N: Downstream_Controller_1 (U8_1.16), Downstream_Port_1 (C36_1.1)
SSTX1_N: Downstream_Controller_2 (U8_2.16), Downstream_Port_2 (C36_2.1)
SSTX1_P: Downstream_Controller_1 (U8_1.17), Downstream_Port_1 (C35_1.1)
SSTX1_P: Downstream_Controller_2 (U8_2.17), Downstream_Port_2 (C35_2.1)
SSTX2_N: Downstream_Controller_1 (U8_1.20), Downstream_Port_1 (C38_1.1)
SSTX2_N: Downstream_Controller_2 (U8_2.20), Downstream_Port_2 (C38_2.1)
SSTX2_P: Downstream_Controller_1 (U8_1.21), Downstream_Port_1 (C37_1.1)
SSTX2_P: Downstream_Controller_2 (U8_2.21), Downstream_Port_2 (C37_2.1)
SSTX_N: Downstream_Controller_1 (U8_1.7), USB_Hub (U3.4)
SSTX_N: USB_Hub (U3.12), Downstream_Controller_2 (U8_2.7)
SSTX_P: Downstream_Controller_1 (U8_1.6), USB_Hub (U3.3)
SSTX_P: USB_Hub (U3.11), Downstream_Controller_2 (U8_2.6)
VBUS: Downstream_Controller_1 (U7_1.6 U7_1.7), Downstream_Port_1 (8 pins)
VBUS: Downstream_Controller_2 (U7_2.6 U7_2.7), Downstream_Port_2 (8 pins)

## Assembly variants
Default: all parts fitted
Flash Disabled: all parts fitted